# Altium schematic sheet Schematics.SchDoc
size A3; SheetTotal: 20
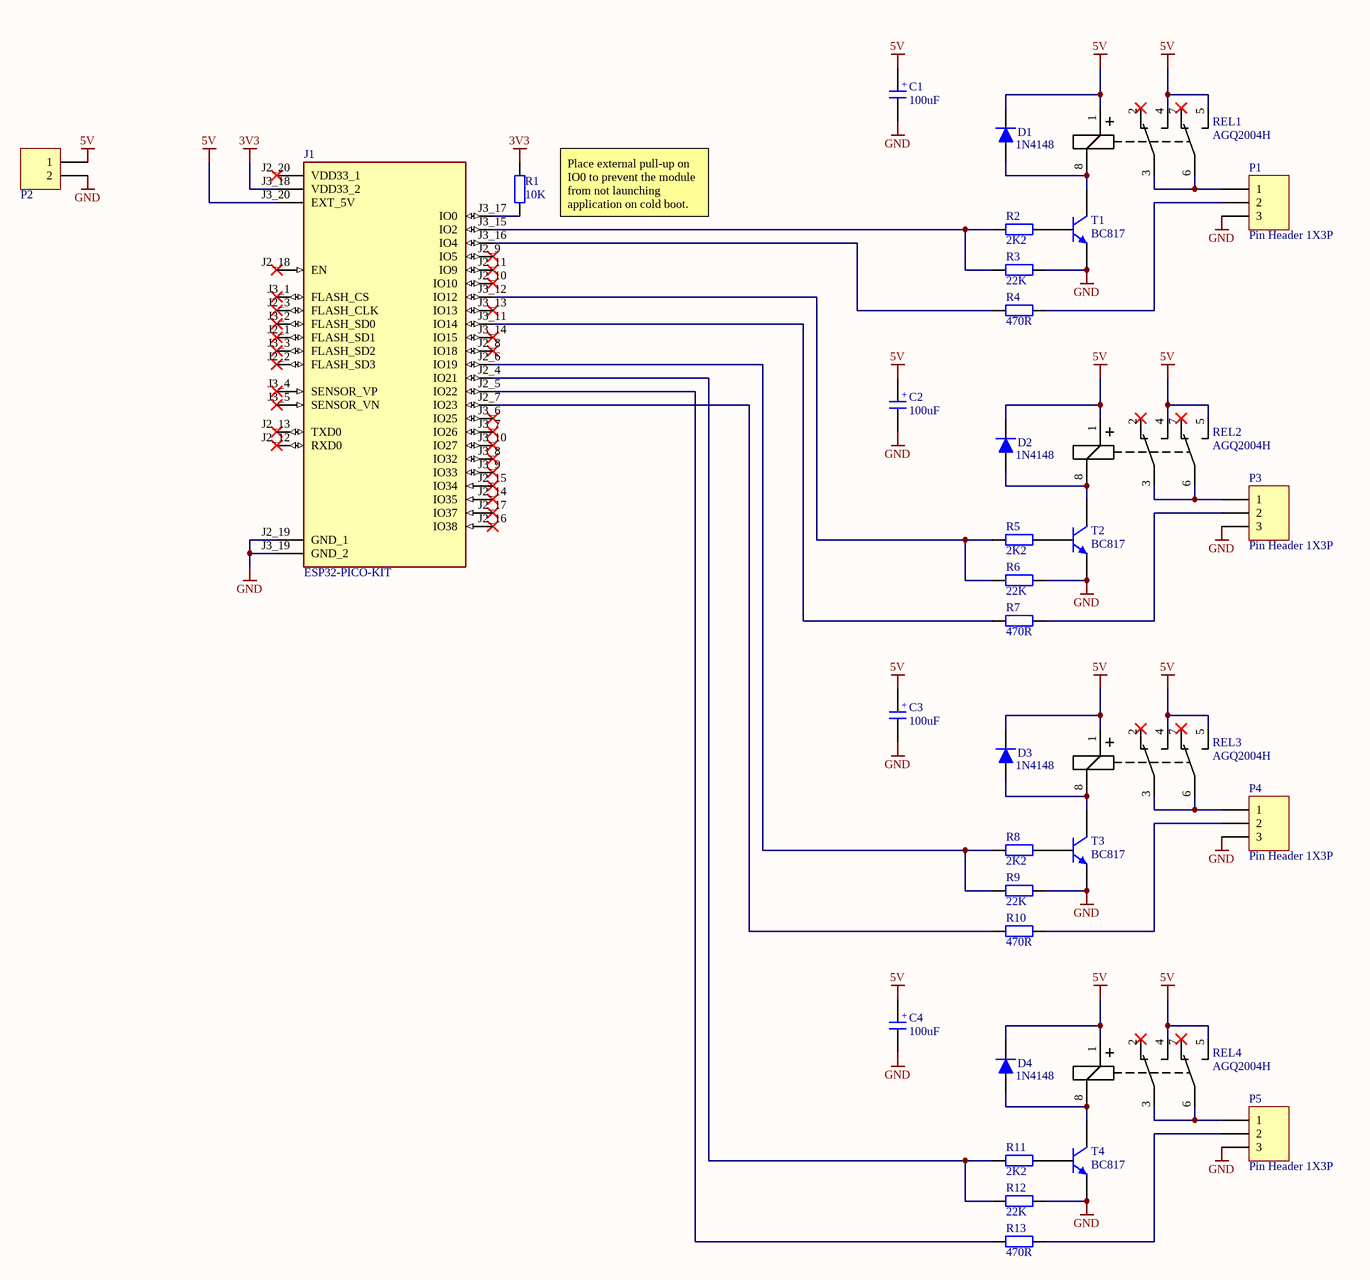
[diagram p0: Schematics.SchDoc]

## Parts
C1  100uF  [EM-Alu-Elco_6,3X8_SMD]
C2  100uF  [EM-Alu-Elco_6,3X8_SMD]
C3  100uF  [EM-Alu-Elco_6,3X8_SMD]
C4  100uF  [EM-Alu-Elco_6,3X8_SMD]
D1  1N4148  [EM-SOD80C T1,5_SMD]
D2  1N4148  [EM-SOD80C T1,5_SMD]
D3  1N4148  [EM-SOD80C T1,5_SMD]
D4  1N4148  [EM-SOD80C T1,5_SMD]
J1  ESP32-PICO-KIT  [XCVR_ESP32-PICO-KIT]
P1  Pin Header 1X3P  [JST XH B3B-XH-A]
P2  Pin Header 1X2P  [JST XH B2B-XH-A]  (value not drawn)
P3  Pin Header 1X3P  [JST XH B3B-XH-A]
P4  Pin Header 1X3P  [JST XH B3B-XH-A]
P5  Pin Header 1X3P  [JST XH B3B-XH-A]
R1  10K  [EM-0603-R T0,45_SMD]
R2  2K2  [EM-0603-R T0,45_SMD]
R3  22K  [EM-0603-R T0,45_SMD]
R4  470R  [EM-0603-R T0,45_SMD]
R5  2K2  [EM-0603-R T0,45_SMD]
R6  22K  [EM-0603-R T0,45_SMD]
R7  470R  [EM-0603-R T0,45_SMD]
R8  2K2  [EM-0603-R T0,45_SMD]
R9  22K  [EM-0603-R T0,45_SMD]
R10  470R  [EM-0603-R T0,45_SMD]
R11  2K2  [EM-0603-R T0,45_SMD]
R12  22K  [EM-0603-R T0,45_SMD]
R13  470R  [EM-0603-R T0,45_SMD]
REL1  AGQ2004H  [THC Relay AGQ]
REL2  AGQ2004H  [THC Relay AGQ]
REL3  AGQ2004H  [THC Relay AGQ]
REL4  AGQ2004H  [THC Relay AGQ]
T1  BC817  [EM-SOT323_SMD]
T2  BC817  [EM-SOT323_SMD]
T3  BC817  [EM-SOT323_SMD]
T4  BC817  [EM-SOT323_SMD]

## Nets
3V3: J1.J3_18(VDD33_2) R1.2
5V: C1.1 C2.1 C3.1 C4.1 D1.1(C) D2.1(C) D3.1(C) D4.1(C) J1.J3_20(EXT_5V) P2.1 REL1.1 REL1.4 REL1.5 REL2.1 REL2.4 REL2.5 REL3.1 REL3.4 REL3.5 REL4.1 REL4.4 REL4.5
GND: C1.2 C2.2 C3.2 C4.2 J1.J2_19(GND_1) J1.J3_19(GND_2) P1.3 P2.2 P3.3 P4.3 P5.3 R3.2 R6.2 R9.2 R12.2 T1.2(E) T2.2(E) T3.2(E) T4.2(E)
NetD1_2: D1.2(A) REL1.8 T1.3(C)
NetD2_2: D2.2(A) REL2.8 T2.3(C)
NetD3_2: D3.2(A) REL3.8 T3.3(C)
NetD4_2: D4.2(A) REL4.8 T4.3(C)
NetJ1_J2_4: J1.J2_4(IO21) R11.1 R12.1
NetJ1_J2_5: J1.J2_5(IO22) R13.1
NetJ1_J2_6: J1.J2_6(IO19) R8.1 R9.1
NetJ1_J2_7: J1.J2_7(IO23) R10.1
NetJ1_J3_11: J1.J3_11(IO14) R7.1
NetJ1_J3_12: J1.J3_12(IO12) R5.1 R6.1
NetJ1_J3_15: J1.J3_15(IO2) R2.1 R3.1
NetJ1_J3_16: J1.J3_16(IO4) R4.1
NetJ1_J3_17: J1.J3_17(IO0) R1.1
NetP1_1: P1.1 REL1.3 REL1.6
NetP1_2: P1.2 R4.2
NetP3_1: P3.1 REL2.3 REL2.6
NetP3_2: P3.2 R7.2
NetP4_1: P4.1 REL3.3 REL3.6
NetP4_2: P4.2 R10.2
NetP5_1: P5.1 REL4.3 REL4.6
NetP5_2: P5.2 R13.2
NetR2_2: R2.2 T1.1(B)
NetR5_2: R5.2 T2.1(B)
NetR8_2: R8.2 T3.1(B)
NetR11_2: R11.2 T4.1(B)

Not connected (* = marked no-connect by the designer): J1 J2_1(FLASH_SD1)* J2_2(FLASH_SD3)* J2_3(FLASH_CLK)* J2_8(IO18)* J2_9(IO5)* J2_10(IO10)* J2_11(IO9)* J2_12(RXD0)* J2_13(TXD0)* J2_14(IO35)* J2_15(IO34)* J2_16(IO38)* J2_17(IO37)* J2_18(EN)* J2_20(VDD33_1)* J3_1(FLASH_CS)* J3_2(FLASH_SD0)* J3_3(FLASH_SD2)* J3_4(SENSOR_VP)* J3_5(SENSOR_VN)* J3_6(IO25)* J3_7(IO26)* J3_8(IO32)* J3_9(IO33)* J3_10(IO27)* J3_13(IO13)* J3_14(IO15)*; REL1 2* 7*; REL2 2* 7*; REL3 2* 7*; REL4 2* 7*

## Notes on the sheet
- (near R1) Place external pull-up on IO0 to prevent the module from not launching application on cold boot.
- Title
- Size:
- Date:
- A3
- Number:
- Time:
- Revision:
- Sheet
- of
- File:
- (in symbol Capacitor Elco) +

## Library data of the parts
C1-C4 = Capacitor Elco: Value: 100uF
D1-D4 = Diode: Value: 1N4148
J1 = ESP32-PICO-KIT: - Transceiver; 802.11 b/g/n _Wi-Fi, WiFi, WLAN_, BluetoothÂ® Smart Ready 4.x Dual Mode For Use With ESP32-PICO-D4; MF: Espressif Systems; Package: None; Availability: Unavailable; Value: *; MP: ESP32-PICO-KIT; SnapEDA_Link: https://www.snapeda.com/parts/ESP32-PICO-KIT/Espressif%20Systems/view-part/2777057/?ref=snap; Price: None
P1 P3-P5 = Header 3: Header 3-Pin; Manufacturer Name: Wurth Elektronik; Manufacturer Part No.: 61300311121; Type: Pin Header 1x3P; Value: Pin Header 1x3P; Supplier Unit Price 1: 0.1; Supplier 1: Wurth Elektronik; Supplier Part Number 1: 61300311121
P2 = Header 2: Header 2-Pin; Manufacturer Name: Wurth Elektronik; Manufacturer Part No.: 61300211121; Type: Pin Header 1x2P; Value: Pin Header 1x2P; Supplier Unit Price 1: 0.1; Supplier 1: Wurth Elektronik; Supplier Part Number 1: 61300211121
R1-R13 = Resistor
  R1: Value: 10K
  R2 R5 R8 R11: Value: 2K2
  R3 R6 R9 R12: Value: 22K
  R4 R7 R10 R13: Value: 470R
REL1-REL4 = Relay AGQ2004H: AGQ2004H -  Signal Relay, 4.5 VDC, DPDT, 2 A, Through Hole, Non Latching, AGQ Series; Manufacturer Name: Panasonic; Manufacturer Part No.: TX2-4.5V; Rcoil: 145R; Operating Current: 31mA; Max. Contact Current: 2A; Value: AGQ2004H; Supplier Unit Price 1: 3.97; Supplier 1: Farnell; Supplier Part Number 1: 3104813; Type: AGQ2004H
T1-T4 = Transistor BC817 (Small): BC817 -  Bipolar (BJT) Single Transistor, NPN, 45 V, 170 MHz, 300 mW, 500 mA, 100 hFE; Manufacturer Name: Nexperia; Manufacturer Part No.: BC817W,115; Gain hFE: 100; Max. Vce: 45V; Rating: 300mW; Nominal Current: 500mA; Value: BC817; Supplier Unit Price 1: 0.045; Supplier 1: Farnell; Supplier Part Number 1: 2114873; Type: BC817